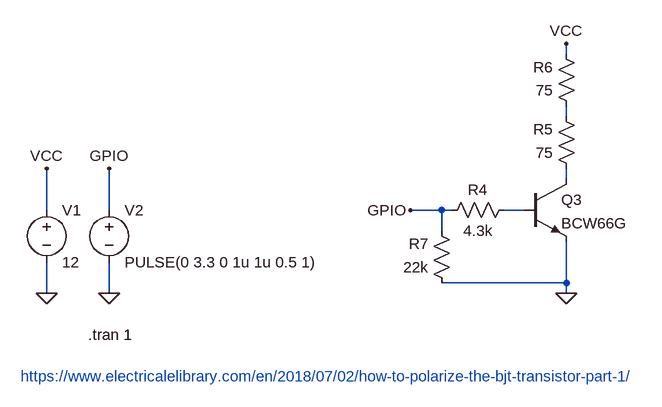
[diagram p0: schematic SwitchingTransistor.asc]
SwitchingTransistor.asc, the LTspice schematic file:
Version 4
SHEET 1 1584 680
WIRE 672 -144 672 -160
WIRE 672 -48 672 -64
WIRE 672 48 672 32
WIRE -128 96 -128 32
WIRE -32 96 -32 32
WIRE 480 96 432 96
WIRE 496 96 480 96
WIRE 608 96 576 96
WIRE 480 128 480 96
WIRE 672 208 672 144
WIRE 672 208 480 208
WIRE -128 224 -128 176
WIRE -32 224 -32 176
WIRE 672 224 672 208
FLAG -128 224 0
FLAG -128 32 VCC
FLAG -32 224 0
FLAG -32 32 GPIO
FLAG 672 -160 VCC
FLAG 672 224 0
FLAG 432 96 GPIO
SYMBOL voltage -128 80 R0
WINDOW 123 0 0 Left 0
WINDOW 39 0 0 Left 0
SYMATTR InstName V1
SYMATTR Value 12
SYMBOL voltage -32 80 R0
WINDOW 123 0 0 Left 0
WINDOW 39 0 0 Left 0
SYMATTR InstName V2
SYMATTR Value PULSE(0 3.3 0 1u 1u 0.5 1)
SYMBOL npn 608 48 R0
SYMATTR InstName Q3
SYMATTR Value BCW66G
SYMBOL res 592 80 R90
WINDOW 0 0 56 VBottom 2
WINDOW 3 32 56 VTop 2
SYMATTR InstName R4
SYMATTR Value 4.3k
SYMBOL res 688 48 R180
WINDOW 0 36 76 Left 2
WINDOW 3 36 40 Left 2
SYMATTR InstName R5
SYMATTR Value 75
SYMBOL res 688 -48 R180
WINDOW 0 36 76 Left 2
WINDOW 3 36 40 Left 2
SYMATTR InstName R6
SYMATTR Value 75
SYMBOL res 496 224 R180
WINDOW 0 36 76 Left 2
WINDOW 3 36 40 Left 2
SYMATTR InstName R7
SYMATTR Value 22k
TEXT -64 288 Left 2 !.tran 1
TEXT -168 352 Left 2 ;https://www.electricalelibrary.com/en/2018/07/02/how-to-polarize-the-bjt-transistor-part-1/

The netlist it stands for:
* SwitchingTransistor.asc
V1 VCC 0 12
V2 GPIO 0 PULSE(0 3.3 0 1u 1u 0.5 1)
Q3 N002 N003 0 0 BCW66G
R4 N003 GPIO 4.3k
R5 N002 N001 75
R6 N001 VCC 75
R7 0 GPIO 22k
.model NPN NPN
.model PNP PNP
.lib standard.bjt
.tran 1
* https://www.electricalelibrary.com/en/2018/07/02/how-to-polarize-the-bjt-transistor-part-1/
.backanno
.end